# Altium schematic sheet 19_USB接口.schdoc.schdoc
size 309 x 223 mm; Symbol: sheet-symbol_a4; Device: Sheet-Symbol_A4; Company: 嘉立创EDA; Version: V1.0; Page Size: A4; @Project Name: RK3568底板_V1.2; @Page Count: 6; @Update Date: 2024-05-17; @Create Date: 2024-04-18; @Schematic Name: 原理图; @Page No: 6; @Page Name: USB接口
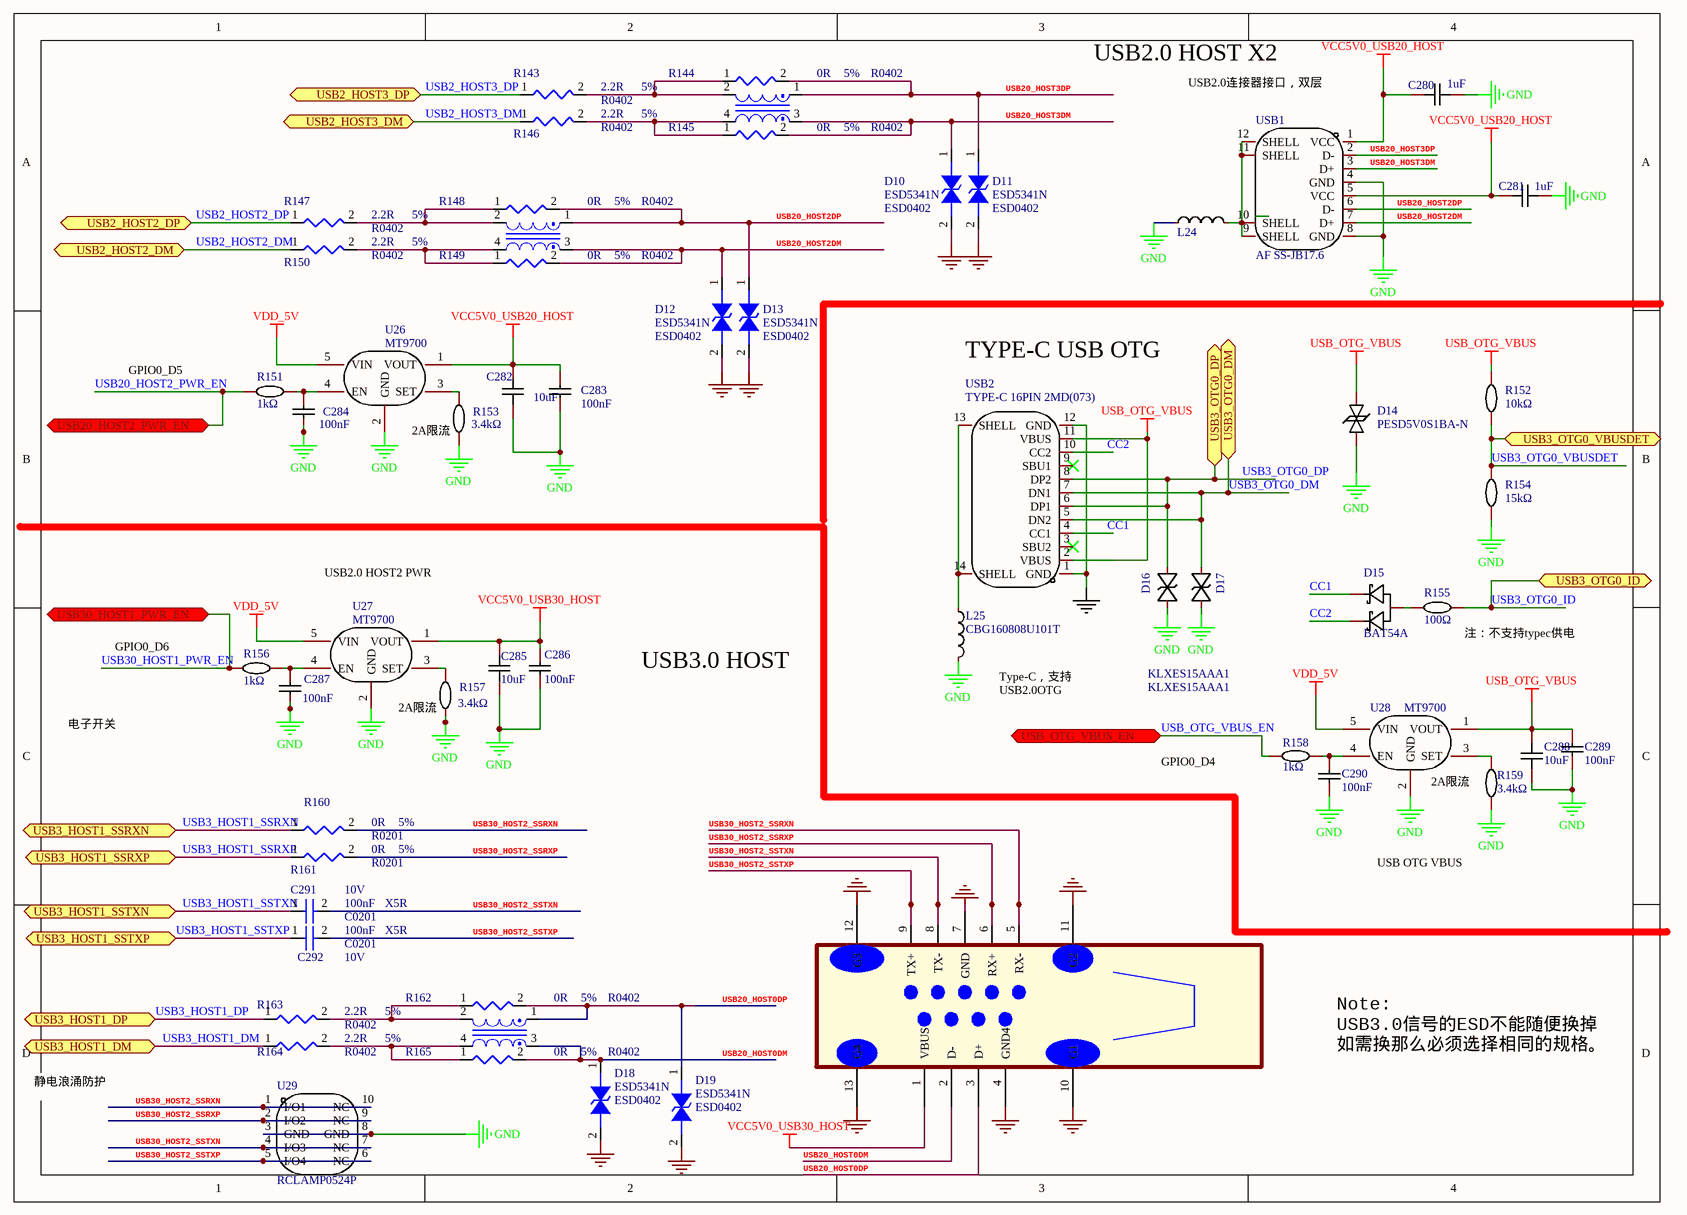
[diagram p0: 19_USB接口.schdoc.schdoc]

## Parts
C280  1uF  [C0603]
C281  1uF  [C0603]
C282  10uF  [C0603]
C283  100nF  [C0603]
C284  100nF  [C0603]
C285  10uF  [C0603]
C286  100nF  [C0603]
C287  100nF  [C0603]
C288  10uF  [C0603]
C289  100nF  [C0603]
C290  100nF  [C0603]
C291  100nF  Voltage: 10V  Dielectric: X5R  [C0201]
C292  100nF  Voltage: 10V  Dielectric: X5R  [C0201]
D10  ESD5341N  [ESD0402]
D11  ESD5341N  [ESD0402]
D12  ESD5341N  [ESD0402]
D13  ESD5341N  [ESD0402]
D14  PESD5V0S1BA-N  [SOD-323_L1.8-W1.3-LS2.5-BI]
D15  BAT54A  [SOT-23-3_L2.9-W1.3-P1.90-LS2.4-BR]
D16  KLXES15AAA1  [D0402-BI]
D17  KLXES15AAA1  [D0402-BI]
D18  ESD5341N  [ESD0402]
D19  ESD5341N  [ESD0402]
J1  USB30_TYPE_A_V_2  [USB30A9_25R70X7R32X13R85]  (value not drawn)
L22  INDUCTOR COM  [RP2_0405]  (value not drawn)
L23  INDUCTOR COM  [RP2_0405]  (value not drawn)
L24  CBG160808U101T  [L0603]  (value not drawn)
L25  CBG160808U101T  [L0603]
L26  INDUCTOR COM  [RP2_0405]  (value not drawn)
R143  2.2R  Tolerance: 5%  [R0402]
R144  0R  Tolerance: 5%  [R0402]
R145  0R  Tolerance: 5%  [R0402]
R146  2.2R  Tolerance: 5%  [R0402]
R147  2.2R  Tolerance: 5%  [R0402]
R148  0R  Tolerance: 5%  [R0402]
R149  0R  Tolerance: 5%  [R0402]
R150  2.2R  Tolerance: 5%  [R0402]
R151  1kΩ  [R0603]
R152  10kΩ  [R0603]
R153  3.4kΩ  [R0603]
R154  15kΩ  [R0603]
R155  100Ω  [R0603]
R156  1kΩ  [R0603]
R157  3.4kΩ  [R0603]
R158  1kΩ  [R0603]
R159  3.4kΩ  [R0603]
R160  0R  PCB Footprint: R0201  Tolerance: 5%  [R0402]
R161  0R  PCB Footprint: R0201  Tolerance: 5%  [R0402]
R162  0R  Tolerance: 5%  [R0402]
R163  2.2R  Tolerance: 5%  [R0402]
R164  2.2R  Tolerance: 5%  [R0402]
R165  0R  Tolerance: 5%  [R0402]
U26  MT9700  [SOT-23-5_L3.0-W1.7-P0.95-LS2.8-BR]
U27  MT9700  [SOT-23-5_L3.0-W1.7-P0.95-LS2.8-BR]
U28  MT9700  [SOT-23-5_L3.0-W1.7-P0.95-LS2.8-BR]
U29  RCLAMP0524P  [DFN2510-10_L2.5-W1.0-P0.50-BL]
USB1  AF SS-JB17.6  [USB-A-TH_AF-SS-JB17.6]
USB2  TYPE-C 16PIN 2MD(073)  [USB-C-SMD_TYPE-C-6PIN-2MD-073]

## Ports
USB2_HOST2_DM (bidir), USB2_HOST2_DP (bidir), USB2_HOST3_DM (bidir), USB2_HOST3_DP (bidir), USB3_HOST1_DM (bidir), USB3_HOST1_DP (bidir), USB3_HOST1_SSRXN (bidir), USB3_HOST1_SSRXP (bidir), USB3_HOST1_SSTXN (bidir), USB3_HOST1_SSTXP (bidir), USB3_OTG0_DM (bidir), USB3_OTG0_DP (bidir), USB3_OTG0_ID (bidir), USB3_OTG0_VBUSDET (bidir), USB20_HOST2_PWR_EN (bidir), USB30_HOST1_PWR_EN (bidir), USB_OTG_VBUS_EN (bidir)

## Nets
GND: C280.1 C281.1 C282.2 C283.2 C284.1 C285.2 C286.2 C287.1 C288.2 C289.2 C290.1 D10.2 D11.2 D12.2 D13.2 D14.1 D16.2(A) D17.2(A) D18.2 D19.2 J1.4(GND4) J1.7(GND) J1.10(G1) J1.11(G2) J1.12(G3) J1.13(G4) L24.1 L25.2 R153.1 R154.1 R157.1 R159.1 U26.2(GND) U27.2(GND) U28.2(GND) U29.3(GND) U29.8(GND) USB1.4(GND) USB1.8(GND) USB2.1(GND) USB2.12(GND)
USB_OTG_VBUS: C288.1 C289.1 D14.2 R152.2 U28.1(VOUT) USB2.2(VBUS) USB2.11(VBUS)
VCC5V0_USB20_HOST: C280.2 C281.2 C282.1 C283.1 U26.1(VOUT) USB1.1(VCC) USB1.5(VCC)
VCC5V0_USB30_HOST: C285.1 C286.1 J1.1(VBUS) U27.1(VOUT)
VDD_5V: U26.5(VIN) U27.5(VIN) U28.5(VIN)
CC1: D15.1(A) USB2.4(CC1)
CC2: D15.2(A) USB2.10(CC2)
USB2_HOST2_DM: R150.1 ; port USB2_HOST2_DM
USB2_HOST2_DP: R147.1 ; port USB2_HOST2_DP
USB2_HOST3_DM: R146.1 ; port USB2_HOST3_DM
USB2_HOST3_DP: R143.1 ; port USB2_HOST3_DP
USB3_HOST1_DM: R164.1 ; port USB3_HOST1_DM
USB3_HOST1_DP: R163.1 ; port USB3_HOST1_DP
USB3_HOST1_SSRXN: R160.1 ; port USB3_HOST1_SSRXN
USB3_HOST1_SSRXP: R161.1 ; port USB3_HOST1_SSRXP
USB3_HOST1_SSTXN: C291.1 ; port USB3_HOST1_SSTXN
USB3_HOST1_SSTXP: C292.1 ; port USB3_HOST1_SSTXP
USB3_OTG0_DM: D17.1(K) USB2.5(DN2) USB2.7(DN1) ; port USB3_OTG0_DM
USB3_OTG0_DP: D16.1(K) USB2.6(DP1) USB2.8(DP2) ; port USB3_OTG0_DP
USB3_OTG0_ID: R155.2 ; port USB3_OTG0_ID
USB3_OTG0_VBUSDET: R152.1 R154.2 ; port USB3_OTG0_VBUSDET
USB20_HOST0DM: D18.1 J1.2(D-) L26.3 R165.2
USB20_HOST0DP: D19.1 J1.3(D+) L26.1 R162.2
USB20_HOST2_PWR_EN: R151.2 ; port USB20_HOST2_PWR_EN
USB20_HOST2DM: D12.1 L23.3 R149.2 USB1.7(D+)
USB20_HOST2DP: D13.1 L23.1 R148.2 USB1.6(D-)
USB20_HOST3DM: D10.1 L22.3 R145.2 USB1.3(D+)
USB20_HOST3DP: D11.1 L22.1 R144.2 USB1.2(D-)
USB30_HOST1_PWR_EN: R156.2 ; port USB30_HOST1_PWR_EN
USB30_HOST2_SSRXN: J1.5(RX-) R160.2 U29.1(I/O1) U29.10(NC)
USB30_HOST2_SSRXP: J1.6(RX+) R161.2 U29.2(I/O2) U29.9(NC)
USB30_HOST2_SSTXN: C291.2 J1.8(TX-) U29.4(I/O3) U29.7(NC)
USB30_HOST2_SSTXP: C292.2 J1.9(TX+) U29.5(I/O4) U29.6(NC)
USB_OTG_VBUS_EN: R158.2 ; port USB_OTG_VBUS_EN
NetC284_2: C284.2 R151.1 U26.4(EN)
NetC287_2: C287.2 R156.1 U27.4(EN)
NetC290_2: C290.2 R158.1 U28.4(EN)
NetD15_3: D15.3(K) R155.1
NetL22_2: L22.2 R143.2 R144.1
NetL22_4: L22.4 R145.1 R146.2
NetL23_2: L23.2 R147.2 R148.1
NetL23_4: L23.4 R149.1 R150.2
NetL24_2: L24.2 USB1.9(SHELL) USB1.10(SHELL) USB1.11(SHELL) USB1.12(SHELL)
NetL25_1: L25.1 USB2.13(SHELL) USB2.14(SHELL)
NetL26_2: L26.2 R162.1 R163.2
NetL26_4: L26.4 R164.2 R165.1
NetR153_2: R153.2 U26.3(SET)
NetR157_2: R157.2 U27.3(SET)
NetR159_2: R159.2 U28.3(SET)

Not connected (* = marked no-connect by the designer): USB2 3(SBU2)* 9(SBU1)*

## Notes on the sheet
- USB2.0 HOST X2
- (near USB1) USB2.0连接器接口，双层
- GPIO0_D5
- TYPE-C USB OTG
- 2A限流
- USB2.0 HOST2 PWR
- GPIO0_D6
- USB3.0 HOST
- (near L25) Type-C，支持USB2.0OTG
- (near R155) 注：不支持typec供电
- 电子开关
- GPIO0_D4
- (near U28) 2A限流
- USB OTG VBUS
- 静电浪涌防护
- Note:
  USB3.0信号的ESD不能随便换掉
  如需换那么必须选择相同的规格。
- 1
- 2
- 3
- 4
- 5
- 6
- A
- B
- C
- 原理图
- 创建日期
- 更新日期
- 2024-05-17
- 2024-04-18
- D
- 审阅
- 绘制
- 图页
- USB接口
- 物料编码
- RK3568底板_V1.2
- 版本
- 尺寸
- 页
- 共
- V1.0
- A4
- 嘉立创EDA

## Library data of the parts
C280 C281 = 0603X105K100NT: Manufacturer: FH(风华); Add into BOM: yes; Tolerance: ±10%; Voltage Rated: 10V; Temperature Coefficient: X5R; Name: 1uF; Symbol: 0603X105K100NT; Device: 0603X105K100NT; LCSC Part Name: 1uF ±10% 10V; Supplier Part: C111590; Manufacturer Part: 0603X105K100NT; Supplier Footprint: 0603; JLCPCB Part Class: 扩展库; Datasheet: https://atta.szlcsc.com/upload/public/pdf/source/20200305/C486355_26A10D38EF8C2A5C37091D0039909270.pdf; Supplier: LCSC; Convert to PCB: yes; Value: 1uF
C282 C285 C288 = CL10A106KP8NNNC: Manufacturer: SAMSUNG(三星); Add into BOM: yes; Tolerance: ±10%; Voltage Rated: 10V; Temperature Coefficient: X5R; Name: 10uF; Symbol: CL10A106KP8NNNC; Device: CL10A106KP8NNNC; Supplier: LCSC; Manufacturer Part: CL10A106KP8NNNC; Value: 10uF; Supplier Part: C19702; JLCPCB Part Class: 基础库; LCSC Part Name: 10uF ±10% 10V; Supplier Footprint: 0603; Datasheet: https://atta.szlcsc.com/upload/public/pdf/source/20160218/1457707763339.pdf; Convert to PCB: yes
C283 C284 C286 C287 C289 C290 = 0603B104K500NT: Manufacturer: FH(风华); Add into BOM: yes; Tolerance: ±10%; Voltage Rated: 50V; Temperature Coefficient: X7R; Name: 100nF; Symbol: 0603B104K500NT; Device: 0603B104K500NT; Supplier: LCSC; Manufacturer Part: 0603B104K500NT; Value: 100nF; Supplier Part: C30926; JLCPCB Part Class: 扩展库; LCSC Part Name: 100nF ±10% 50V; Supplier Footprint: 0603; Datasheet: https://atta.szlcsc.com/upload/public/pdf/source/20200305/C486355_26A10D38EF8C2A5C37091D0039909270.pdf; Convert to PCB: yes
C291 C292 = CAP NP: cap,100.00nF,+/-10%,10V,X5R,C0201; Manufacturer PN: C0603X5R1A104K030BC; Manufacturer: TDK; C_Voltage: 6.3V; Tolerance: 10%; Priority: A; Number: 37; PCB Footprint: C0201; Created by: JJJ; Part Type: C0201; RK PN: C0603X5R1A104K030BC
D10-D13 D18 D19 = DIODE BI_DIR TRIG: 1-Line, Bi-directional, Transient Voltage Suppressors.1pF.; Manufacturer: WillSemi(韦尔半导体); Priority: A; PCB Footprint: ESD0402; Created by: JJJ; Manufacturer PN: ESD5341N; Part Type: ESD_TVS; RK PN: ESD5341N
D14 = PESD5V0S1BA-N: Manufacturer: BORN(伯恩半导体); Add into BOM: yes; polarity: 双向; Reverse Stand-Off Voltage (Vrwm): 5V; Maximum Clamping Voltage: 21V; Peak Pulse Current (Ipp)@10/1000us: 17A; Breakdown Voltage: 6V; Type: ESD; Name: PESD5V0S1BA-N; Symbol: PESD5V0S1BA-N; Device: PESD5V0S1BA-N; Supplier: LCSC; Supplier Part: C314260; Manufacturer Part: PESD5V0S1BA-N; JLCPCB Part Class: 扩展库; LCSC Part Name: 双向ESD; Supplier Footprint: SOD-323; Datasheet: https://atta.szlcsc.com/upload/public/pdf/source/20181015/C314260_74616720B766DD44AADECF2576FF880A.pdf; Convert to PCB: yes
D15 = BAT54A_C727124: Manufacturer: TWGMC(台湾迪嘉); Add into BOM: yes; Diode Configuration: 1对共阳极; Forward Voltage (Vf@If): 1V@100mA; Reverse Voltage (Vr): 30V; Average Rectified Current (Io): 200mA; Reverse Leakage Current (Ir): 2uA@25V; Name: BAT54A; Symbol: BAT54A_C727124; Device: BAT54A_C727124; Supplier: LCSC; Supplier Part: C727124; Manufacturer Part: BAT54A; JLCPCB Part Class: 扩展库; LCSC Part Name: 电压:30V 电流:200mA; Supplier Footprint: SOT-23; Datasheet: https://atta.szlcsc.com/upload/public/pdf/source/20200827/C727124_5D482B6B1AEFE8F49931502BEAC75010.pdf; Convert to PCB: yes
D16 D17 = KLXES15AAA1: Manufacturer: KUU; Add into BOM: yes; polarity: 双向; Reverse Stand-Off Voltage (Vrwm): 5V; Maximum Clamping Voltage: 40V; Reverse Leakage Current (Ir): 10nA; Number of Lines: 单路; Type: ESD; Name: KLXES15AAA1; Symbol: KLXES15AAA1; Device: KLXES15AAA1; Supplier: LCSC; Supplier Part: C2892490; Manufacturer Part: KLXES15AAA1; JLCPCB Part Class: 扩展库; LCSC Part Name: 双向ESD; Supplier Footprint: 0402; Datasheet: https://atta.szlcsc.com/upload/public/pdf/source/20210908/40FD94D5521B4EF0ED53BC030E77ED53.pdf; Convert to PCB: yes; Operating Temperature: -55℃~+125℃@(Tj)
L24 L25 = CBG160808U101T: Manufacturer: FH(风华); Add into BOM: yes; Impedance @ Frequency: 100Ω@100MHz; Tolerance: ±25%; DC Resistance: 300mΩ; Current Rating: 200mA; Circuits: 1; Name: CBG160808U101T; Symbol: CBG160808U101T; Device: CBG160808U101T; LCSC Part Name: 单路 0603磁珠 阻抗100Ω@100MHz; Supplier Part: C98498; Manufacturer Part: CBG160808U101T; Supplier Footprint: 0603; JLCPCB Part Class: 扩展库; Datasheet: https://atta.szlcsc.com/upload/public/pdf/source/20190129/C361667_1614D407CC98D1D3CFBD9E1F7511C14D.pdf; Supplier: LCSC; Convert to PCB: yes
R143 R147 R163 R164 = RESISTOR_Dup1: 通用厚膜电阻,2R2,+/-5%,R0402,1/16W.; Manufacturer: YAGEO; RK PN: RC0402JR-072R2L; Priority: A; Wattage: 1/16W; PCB Footprint: R0402; Part Type: 通用厚膜电阻; Manufacturer PN: RC0402JR-072R2L; Created by: YTL
R144 R145 R148 R149 R165 = RESISTOR_Dup1: 通用厚膜电阻,0R,+/-5%,R0402,1/16W.; Manufacturer: YAGEO; RK PN: RC0402JR-070RL; Priority: A; Wattage: 1/16W; PCB Footprint: R0402; Part Type: 通用厚膜电阻; Manufacturer PN: RC0402JR-070RL; Created by: YTL
R146 R150 = RESISTOR_Dup1: 通用厚膜电阻,2R2,+/-5%,R0402,1/16W.; Manufacturer PN: RC0402JR-072R2L; Manufacturer: YAGEO; Wattage: 1/16W; Priority: A; PCB Footprint: R0402; Created by: YTL; Part Type: 通用厚膜电阻; RK PN: RC0402JR-072R2L
R151 R156 R158 = 0603WAF1001T5E: Manufacturer: UNI-ROYAL(厚声); Add into BOM: yes; Tolerance: ±1%; Power(Watts): 100mW; Overload Voltage (Max): 75V; Temperature Coefficient: ±100ppm/℃; Name: 1kΩ; Symbol: 0603WAF1001T5E; Device: 0603WAF1001T5E; Supplier: LCSC; Manufacturer Part: 0603WAF1001T5E; Supplier Part: C21190; Value: 1kΩ; JLCPCB Part Class: 基础库; LCSC Part Name: 1kΩ ±1% 100mW 厚膜电阻; Supplier Footprint: 0603; Datasheet: https://atta.szlcsc.com/upload/public/pdf/source/20200306/C422600_1E6D84923E4A46A82E41ADD87F860B5C.pdf; Convert to PCB: yes; Type: 厚膜电阻; Operating Temperature Range: -55℃~+155℃
R152 = 0603WAF1002T5E: Manufacturer: UNI-ROYAL(厚声); Add into BOM: yes; Tolerance: ±1%; Power(Watts): 100mW; Overload Voltage (Max): 75V; Temperature Coefficient: ±100ppm/℃; Name: 10kΩ; Symbol: 0603WAF1002T5E; Device: 0603WAF1002T5E; Supplier: LCSC; Manufacturer Part: 0603WAF1002T5E; Supplier Part: C25804; Value: 10kΩ; JLCPCB Part Class: 基础库; LCSC Part Name: 厚膜电阻 10kΩ ±1% 100mW; Supplier Footprint: 0603; Datasheet: https://atta.szlcsc.com/upload/public/pdf/source/20200306/C422600_1E6D84923E4A46A82E41ADD87F860B5C.pdf; Convert to PCB: yes; Type: 厚膜电阻; Operating Temperature Range: -55℃~+155℃
R153 R157 R159 = 0603WAF3401T5E: Manufacturer: UNI-ROYAL(厚声); Add into BOM: yes; Tolerance: ±1%; Power(Watts): 100mW; Overload Voltage (Max): 75V; Temperature Coefficient: ±100ppm/℃; Name: 3.4kΩ; Symbol: 0603WAF3401T5E; Device: 0603WAF3401T5E; Supplier: LCSC; Manufacturer Part: 0603WAF3401T5E; Supplier Part: C22997; Value: 3.4kΩ; JLCPCB Part Class: 扩展库; LCSC Part Name: 3.4kΩ ±1% 100mW 厚膜电阻; Supplier Footprint: 0603; Datasheet: https://atta.szlcsc.com/upload/public/pdf/source/20200306/C422600_1E6D84923E4A46A82E41ADD87F860B5C.pdf; Convert to PCB: yes; Type: 厚膜电阻; Operating Temperature Range: -55℃~+155℃
R154 = 0603WAF1502T5E: Manufacturer: UNI-ROYAL(厚声); Add into BOM: yes; Tolerance: ±1%; Power(Watts): 100mW; Overload Voltage (Max): 75V; Temperature Coefficient: ±100ppm/℃; Name: 15kΩ; Symbol: 0603WAF1502T5E; Device: 0603WAF1502T5E; Supplier: LCSC; Manufacturer Part: 0603WAF1502T5E; Supplier Part: C22809; Value: 15kΩ; JLCPCB Part Class: 基础库; LCSC Part Name: 15kΩ ±1% 100mW 厚膜电阻; Supplier Footprint: 0603; Datasheet: https://atta.szlcsc.com/upload/public/pdf/source/20200306/C422600_1E6D84923E4A46A82E41ADD87F860B5C.pdf; Convert to PCB: yes; Type: 厚膜电阻; Operating Temperature Range: -55℃~+155℃
R155 = RC0603FR-07100RL: Manufacturer: YAGEO(国巨); Add into BOM: yes; Tolerance: ±1%; Power(Watts): 100mW; Overload Voltage (Max): 75V; Temperature Coefficient: ±100ppm/℃; Name: 100Ω; Symbol: RC0603FR-07100RL; Device: RC0603FR-07100RL; LCSC Part Name: 厚膜电阻 100Ω ±1% 100mW; Supplier Part: C105588; Manufacturer Part: RC0603FR-07100RL; Supplier Footprint: 0603; JLCPCB Part Class: 扩展库; Datasheet: https://atta.szlcsc.com/upload/public/pdf/source/20180316/70C0E2BDAE7FCC62C531A5A58D202EE1.pdf; Supplier: LCSC; Convert to PCB: yes; Type: 厚膜电阻; Value: 100Ω; Operating Temperature Range: -55℃~+155℃
R160 R161 = RESISTOR_Dup1: 通用厚膜电阻,0R,+/-5%,R0201,1/20W.; Manufacturer: YAGEO; RK PN: RC0201JR-070RL; Priority: A; Wattage: 1/20W; Part Type: 通用厚膜电阻; Manufacturer PN: RC0201JR-070RL; Created by: YTL
R162 = RESISTOR_Dup1: 通用厚膜电阻,0R,+/-5%,R0402,1/16W.; Manufacturer PN: RC0402JR-070RL; Manufacturer: YAGEO; Wattage: 1/16W; Priority: A; PCB Footprint: R0402; Created by: YTL; Part Type: 通用厚膜电阻; RK PN: RC0402JR-070RL
U26-U28 = MT9700: Manufacturer: 西安航天民芯; Add into BOM: yes; Name: MT9700; Symbol: MT9700; Device: MT9700; LCSC Part Name: MT9700; Supplier Part: C89855; Manufacturer Part: MT9700; Supplier Footprint: SOT-23-5; JLCPCB Part Class: 扩展库; Datasheet: https://atta.szlcsc.com/upload/public/pdf/source/20170418/1492481333031.pdf; Supplier: LCSC; Convert to PCB: yes
U29 = RCLAMP0524P_C907837: Manufacturer: TECH PUBLIC(台舟); Add into BOM: yes; Name: RCLAMP0524P; Symbol: RCLAMP0524P_C907837; Device: RCLAMP0524P_C907837; LCSC Part Name: RCLAMP0524P; Supplier Part: C907837; Manufacturer Part: RCLAMP0524P; Supplier Footprint: DFN2510-10; JLCPCB Part Class: 扩展库; Datasheet: https://atta.szlcsc.com/upload/public/pdf/source/20210810/AE3DE9AC94AD2A317FD9BEA10653400F.pdf; Supplier: LCSC; Convert to PCB: yes; Type: ESD
USB1 = AF SS-JB17.6: Manufacturer: SHOU HAN(首韩); Add into BOM: yes; Connector Type: Type-A; Gender: 母; Number of Ports: 2; Number of Contacts: 4P+4P; Current Rating - Power (Max): 1.5A; Name: AF SS-JB17.6; Symbol: AF SS-JB17.6; Device: AF SS-JB17.6; Supplier: LCSC; Supplier Part: C456021; Manufacturer Part: AF SS-JB17.6; JLCPCB Part Class: 扩展库; LCSC Part Name: Type-A 母 弯插; Supplier Footprint: 插件; Datasheet: https://atta.szlcsc.com/upload/public/pdf/source/20191113/C456021_DAD2CFBF46E609FF6653446337360E6B.pdf; Convert to PCB: yes; Standard: USB 2.0; Mounting Style: 弯插; Operating Temperature Range: -25℃~+85℃
USB2 = TYPE-C 16PIN 2MD(073): Manufacturer: SHOU HAN(首韩); Add into BOM: yes; Gender: 母; Number of Ports: 1; Number of Contacts: 16P; Current Rating - Power (Max): 5A; Name: TYPE-C 16PIN 2MD(073); Symbol: TYPE-C 16PIN 2MD(073); Device: TYPE-C 16PIN 2MD(073); Supplier: LCSC; Supplier Part: C2765186; Manufacturer Part: TYPE-C 16PIN 2MD(073); JLCPCB Part Class: 扩展库; LCSC Part Name: Type-C 母 卧贴; Supplier Footprint: SMD; Datasheet: https://atta.szlcsc.com/upload/public/pdf/source/20211123/39B17C16241EAC15C5E277BDA434118E.pdf; Convert to PCB: yes; Connector Type: Type-C; Standard: -; Mounting Style: 卧贴; Operating Temperature Range: -25℃~+85℃